# EasyEDA schematic SCH_stc8a8k64s4a12核心板_2021-08-17.json
TITLE: STC8A8K64S4A12核心板; REV: 1.1; Date: 2020-12-21; Sheet: 1/1; Drawn By: JensenHua
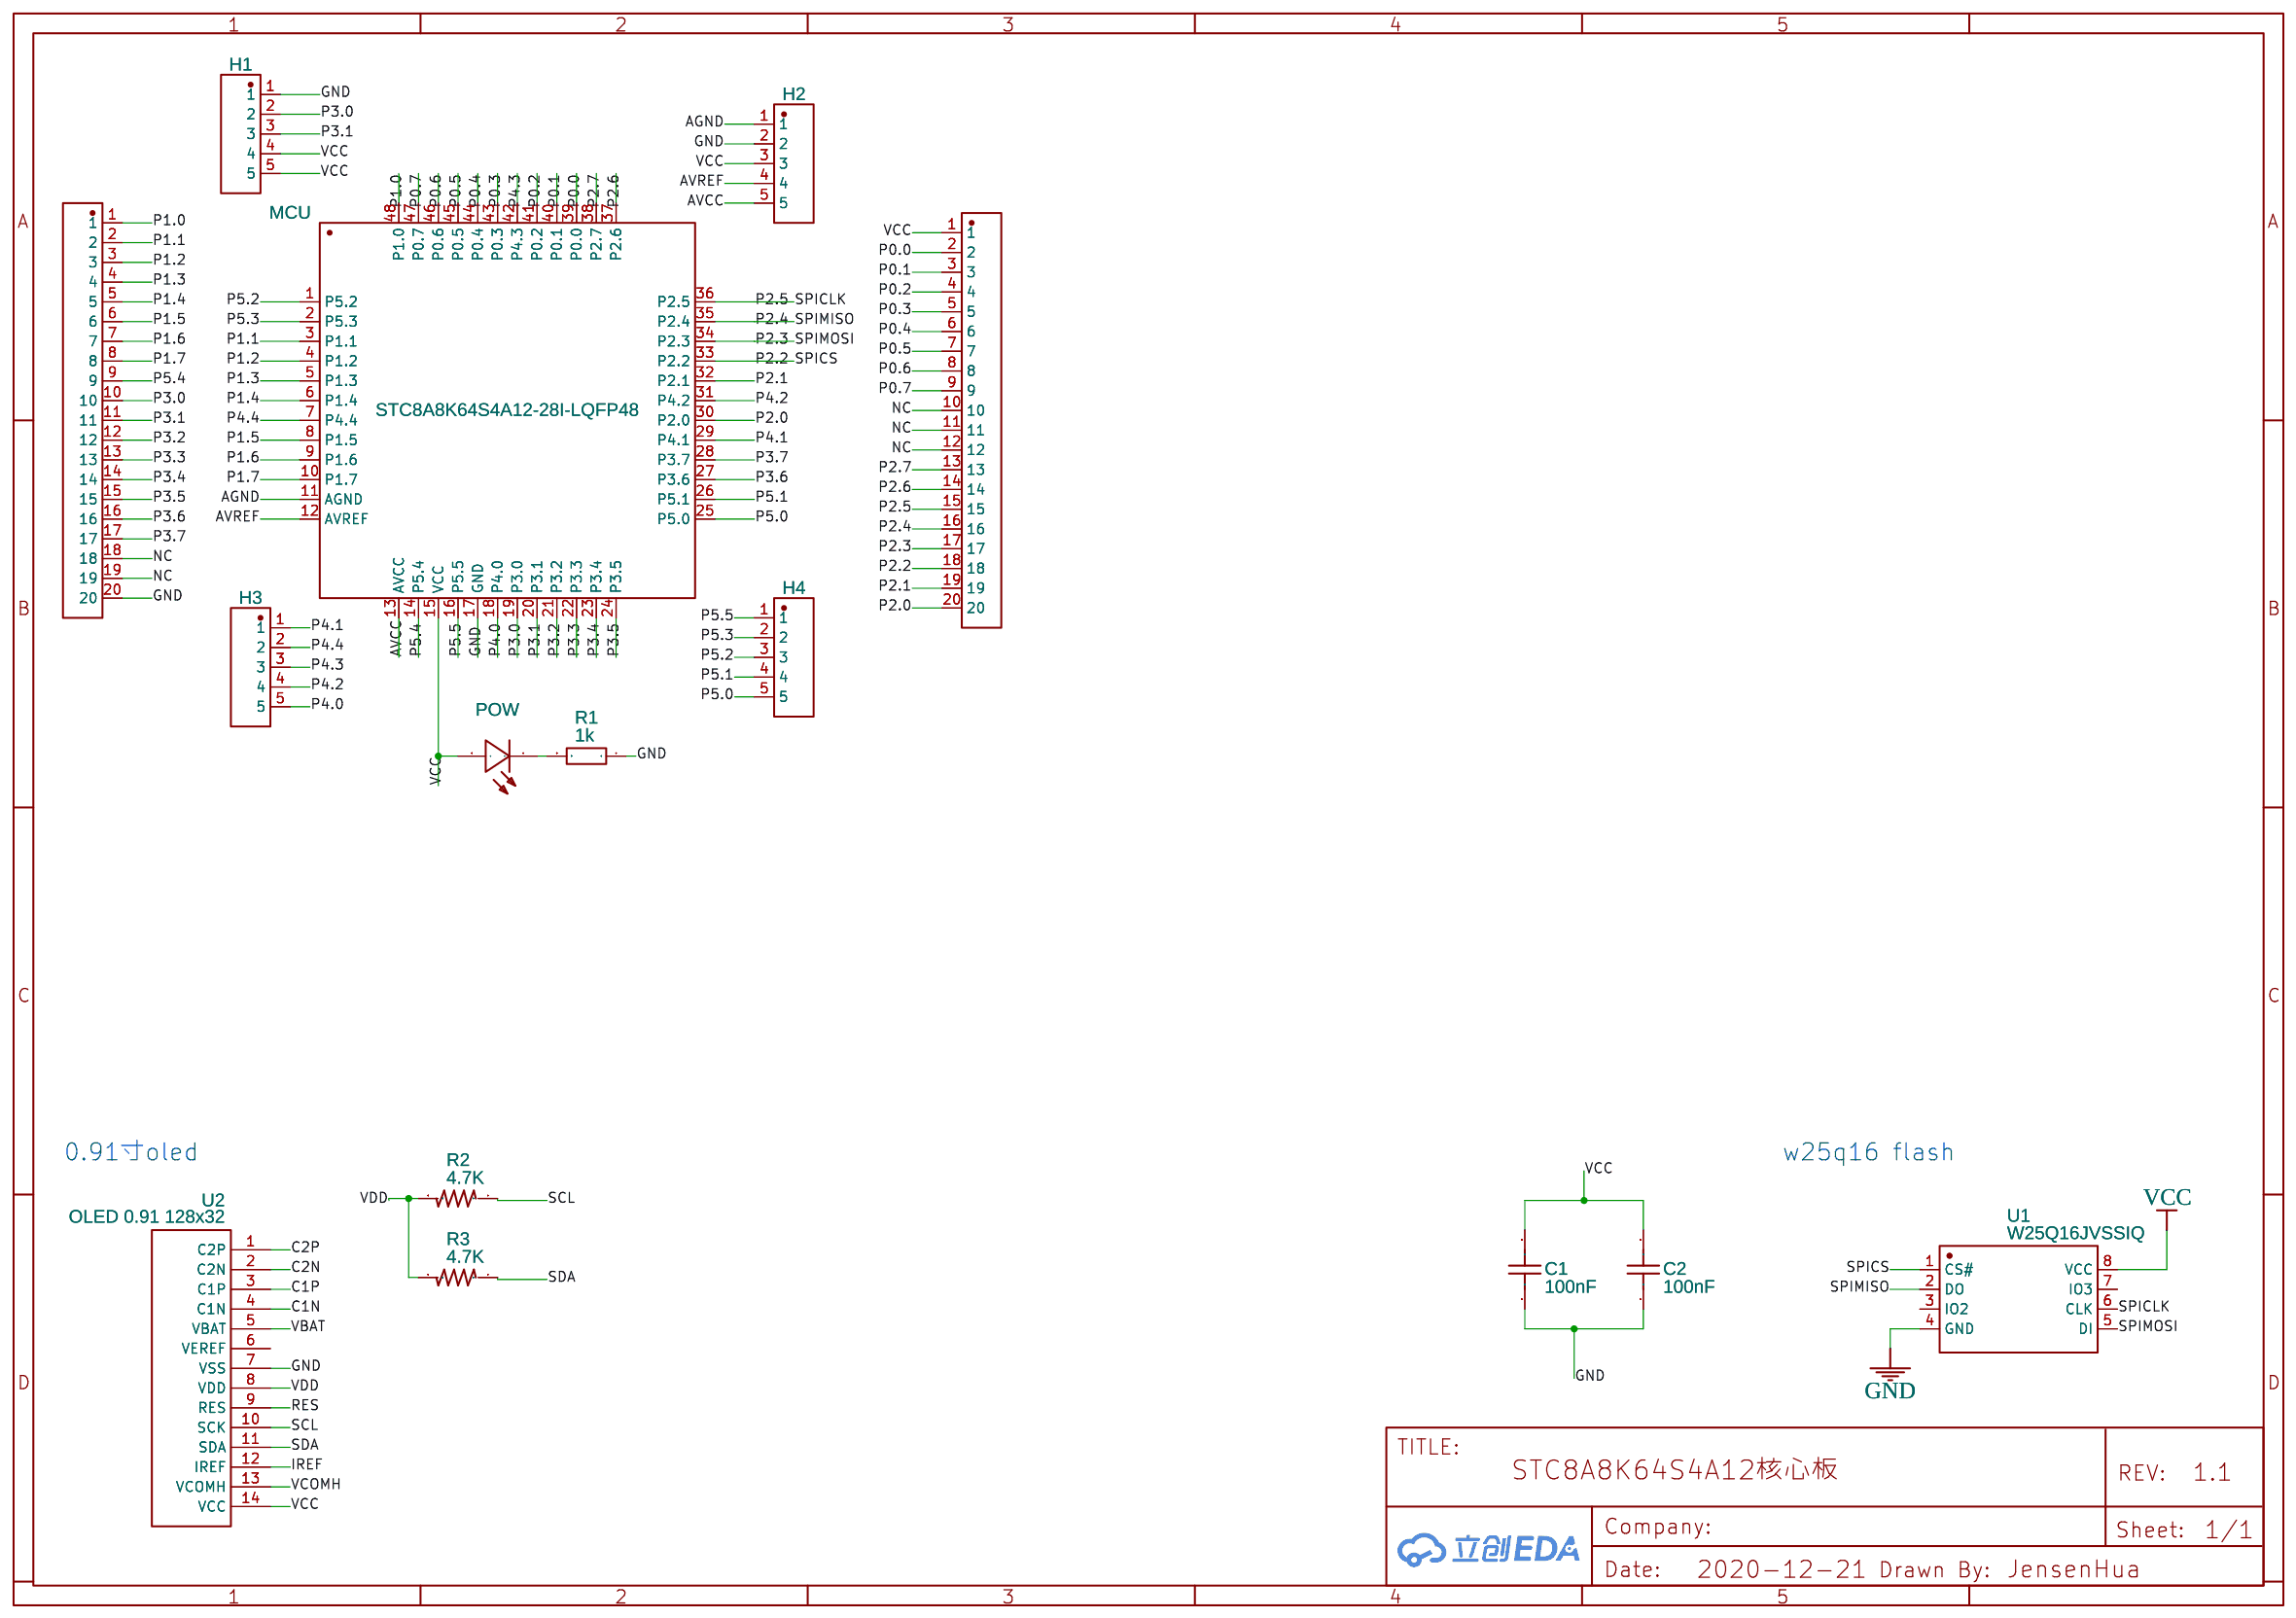
[diagram p0: schematic sheet]

## Parts
C1  100nF  [C0603]
C2  100nF  [C0603]
H1  2185-105SSNAYNT2  [HDR-TH_5P-P2.54-V-F]
H2  2185-105SSNAYNT2  [HDR-TH_5P-P2.54-V-F]
H3  2185-105SSNAYNT2  [HDR-TH_5P-P2.54-V-F]
H4  2185-105SSNAYNT2  [HDR-TH_5P-P2.54-V-F]
J  Header-Male-2.54_1x20  [HDR-TH_20P-P2.54-V]
J1  Header-Male-2.54_1x20  [HDR-TH_20P-P2.54-V]
MCU  STC8A8K64S4A12-28I-LQFP48  [LQFP-48_L7.0-W7.0-P0.50-LS9.0-BL]
POW  led Green  [D0603-RD]
R1  1k  [C0603]
R2  4.7K  [0603-RES]
R3  4.7K  [0603-RES]
U1  W25Q16JVSSIQ  [SOP-8_L5.3-W5.3-P1.27-LS8.0-BL]
U2  OLED 0.91 128x32  [OLED-0.91 BARE]

## Library data of the parts
C1 C2 = FM18X104K101PBG: Supplier: LCSC; Supplier Part: C525175; Manufacturer: PSA(Prosperity Dielectrics); Contributor: LCSC
H1-H4 = 2185-105SSNAYNT2: Supplier: LCSC; Supplier Part: C721789; Manufacturer: Wcon; Contributor: LCSC
J J1 = Header-Male-2.54_1x20: Supplier: LCSC; Manufacturer: BOOMELE; Manufacturer Part: 2.54mm 1*20PHeader; image: //image.lceda.cn/szlcsc/C50981.jpg; Supplier Part: C50981
MCU = STC8A8K64S4A12_C84390: Supplier: LCSC; Supplier Part: C84390; Manufacturer: STC Micro; Manufacturer Part: STC8A8K64S4A12; Contributor: LCSC; SMT Type: Extend; JLCPCB SMD: Yes
POW = led Green: Supplier: LCSC; Manufacturer: KENTO; image: //image.lceda.cn/szlcsc/C14641.jpg; Supplier Part: C14641; LCSC Assembly: Yes; SMT Type: Extend
R1 = 0603: Supplier: LCSC; Manufacturer Part: 0603WAF1000T5E; LCSC Assembly: Yes; Supplier Part: C22775
R2 R3 = 4.7K: Contributor: 乌龟科技
U1 = W25Q64JVSSIQ: Supplier: LCSC; Manufacturer: WINBOND; image: //image.lceda.cn/szlcsc/C83140.jpg; Supplier Part: C83140; SMT Type: Extend; JLCPCB SMD: Yes
U2 = OLED 0.91 128x32: link: https://it.aliexpress.com/wholesale?catId=0&initiative_id=SB_20171110164207&SearchText=0.91+oled; Contributor: davidex720

## Nets
AGND: H2.1 MCU.11(AGND)
AVCC: H2.5 MCU.13(AVCC)
GND: C1.1 C2.1 H1.1 H2.2 J1.20 MCU.17(GND) R1.1 U1.4(GND) U2.7(VSS)
VBAT: U2.5(VBAT)
VCC: C1.2 C2.2 H1.4 H1.5 H2.3 J.1 MCU.15(VCC) POW.2(+) U1.8(VCC) U2.14(VCC)
VDD: R2.2 R3.2 U2.8(VDD)
AVREF: H2.4 MCU.12(AVREF)
C1N: U2.4(C1N)
C1P: U2.3(C1P)
C2N: U2.2(C2N)
C2P: U2.1(C2P)
IREF: U2.12(IREF)
NC: J.10 J.11 J.12 J1.18 J1.19
P0.0: J.2 MCU.39(P0.0)
P0.1: J.3 MCU.40(P0.1)
P0.2: J.4 MCU.41(P0.2)
P0.3: J.5 MCU.43(P0.3)
P0.4: J.6 MCU.44(P0.4)
P0.5: J.7 MCU.45(P0.5)
P0.6: J.8 MCU.46(P0.6)
P0.7: J.9 MCU.47(P0.7)
P1.0: J1.1 MCU.48(P1.0)
P1.1: J1.2 MCU.3(P1.1)
P1.2: J1.3 MCU.4(P1.2)
P1.3: J1.4 MCU.5(P1.3)
P1.4: J1.5 MCU.6(P1.4)
P1.5: J1.6 MCU.8(P1.5)
P1.6: J1.7 MCU.9(P1.6)
P1.7: J1.8 MCU.10(P1.7)
P2.0: J.20 MCU.30(P2.0)
P2.1: J.19 MCU.32(P2.1)
P2.2: J.18 MCU.33(P2.2) U1.1(CS#)
P2.3: J.17 MCU.34(P2.3) U1.5(DI)
P2.4: J.16 MCU.35(P2.4) U1.2(DO)
P2.5: J.15 MCU.36(P2.5) U1.6(CLK)
P2.6: J.14 MCU.37(P2.6)
P2.7: J.13 MCU.38(P2.7)
P3.0: H1.2 J1.10 MCU.19(P3.0)
P3.1: H1.3 J1.11 MCU.20(P3.1)
P3.2: J1.12 MCU.21(P3.2)
P3.3: J1.13 MCU.22(P3.3)
P3.4: J1.14 MCU.23(P3.4)
P3.5: J1.15 MCU.24(P3.5)
P3.6: J1.16 MCU.27(P3.6)
P3.7: J1.17 MCU.28(P3.7)
P4.0: H3.5 MCU.18(P4.0)
P4.1: H3.1 MCU.29(P4.1)
P4.2: H3.4 MCU.31(P4.2)
P4.3: H3.3 MCU.42(P4.3)
P4.4: H3.2 MCU.7(P4.4)
P5.0: H4.5 MCU.25(P5.0)
P5.1: H4.4 MCU.26(P5.1)
P5.2: H4.3 MCU.1(P5.2)
P5.3: H4.2 MCU.2(P5.3)
P5.4: J1.9 MCU.14(P5.4)
P5.5: H4.1 MCU.16(P5.5)
RES: U2.9(RES)
SCL: R2.1 U2.10(SCK)
SDA: R3.1 U2.11(SDA)
VCOMH: U2.13(VCOMH)
Net-(POW-1): POW.1(-) R1.2

Not connected (* = marked no-connect by the designer): U1 3(IO2) 7(IO3); U2 6(VEREF)

## Notes on the sheet
- 0.91寸oled
- w25q16 flash
